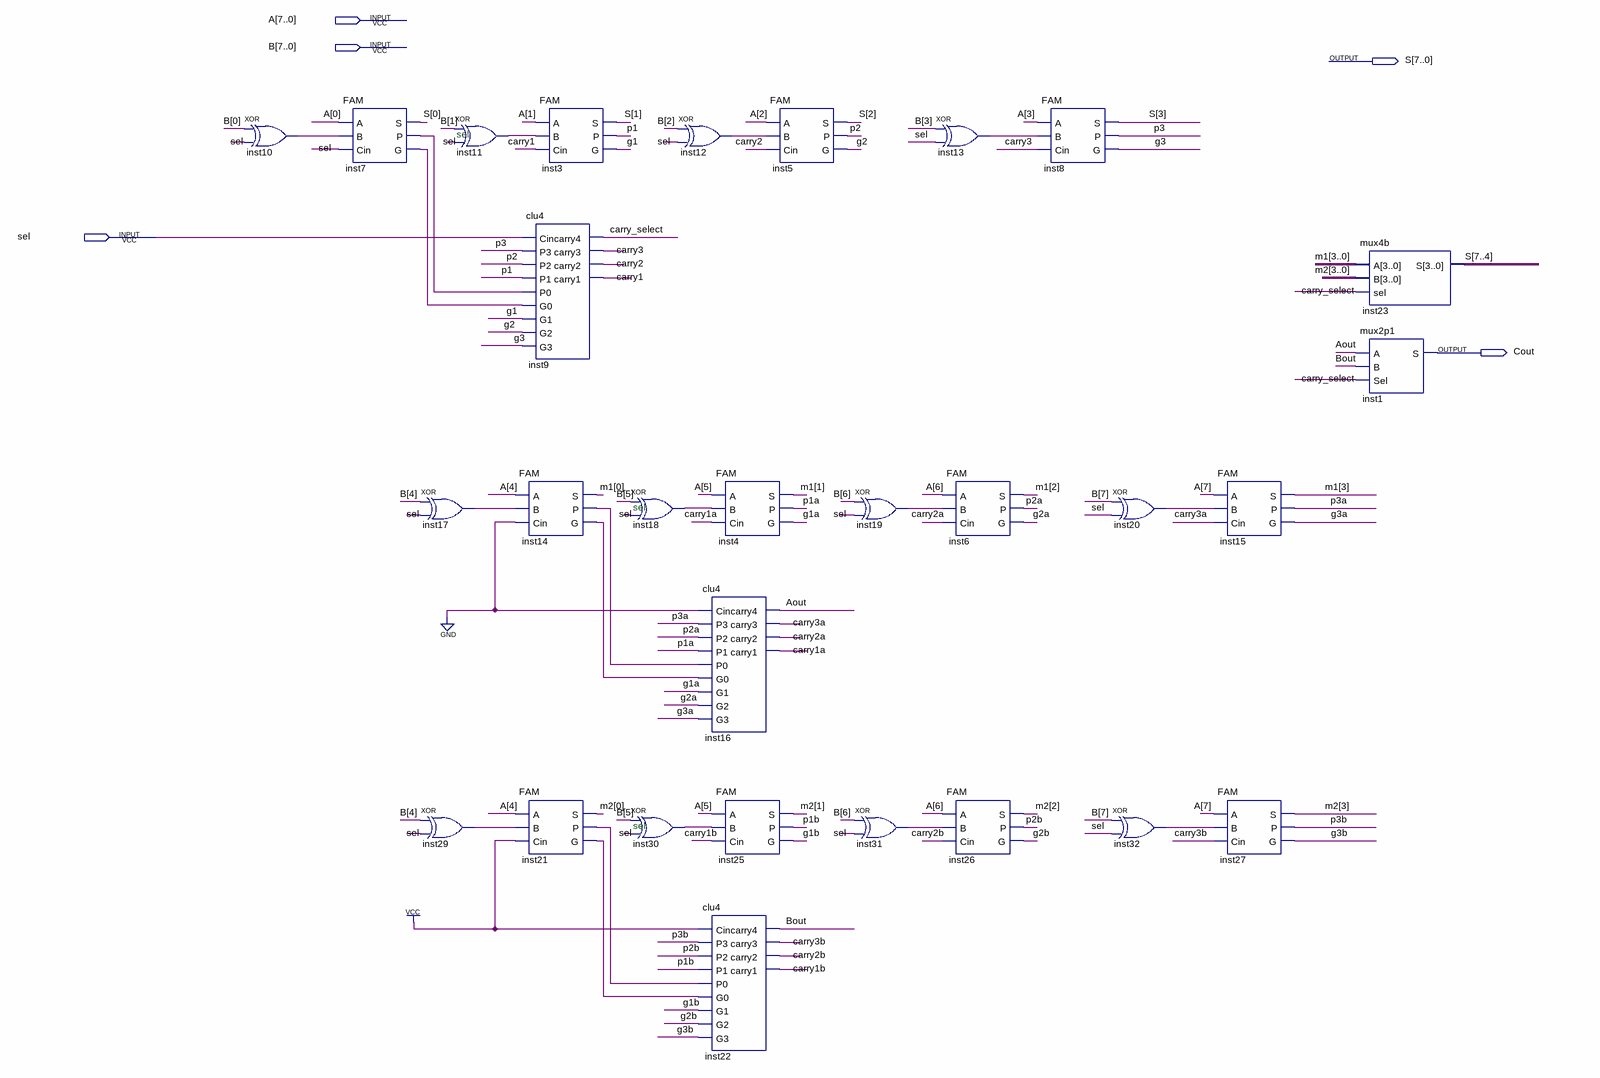
[diagram p0: schematic sheet]
// Quartus schematic cslaclas8.bdf as structural Verilog: 29 symbols, 5 pins
module cslaclas8 (
  input  [7:0] A,
  input  [7:0] B,
  input  sel,
  output [7:0] S,
  output Cout
);

  wire Aout, Bout, carry1, carry1a, carry1b, carry2, carry2a, carry2b, carry3, carry3a, carry3b,
       carry_select, g1, g1a, g1b, g2, g2a, g2b, g3, g3a, g3b, inst7_g, inst7_p, inst10_out, inst11_out,
       inst12_out, inst13_out, inst14_g, inst14_p, inst17_out, inst18_out, inst19_out, inst20_out, inst21_g,
       inst21_p, inst29_out, inst30_out, inst31_out, inst32_out, p1, p1a, p1b, p2, p2a, p2b, p3, p3a, p3b;
  wire [3:0] m1, m2;

  xor inst10 (inst10_out, B[0], sel);
  FAM inst7 (.A(A[0]), .B(inst10_out), .Cin(sel), .S(S[0]), .P(inst7_p), .G(inst7_g));
  xor inst17 (inst17_out, B[4], sel);
  xor inst29 (inst29_out, B[4], sel);
  xor inst11 (inst11_out, B[1], sel);
  FAM inst3 (.A(A[1]), .B(inst11_out), .Cin(carry1), .S(S[1]), .P(p1), .G(g1));
  clu4 inst9 (
    .Cin(sel), .P3(p3), .P2(p2), .P1(p1), .P0(inst7_p), .G0(inst7_g), .G1(g1), .G2(g2), .G3(g3),
    .carry4(carry_select), .carry3(carry3), .carry2(carry2), .carry1(carry1));
  FAM inst14 (.A(A[4]), .B(inst17_out), .Cin(1'b0), .S(m1[0]), .P(inst14_p), .G(inst14_g));
  FAM inst21 (.A(A[4]), .B(inst29_out), .Cin(1'b1), .S(m2[0]), .P(inst21_p), .G(inst21_g));
  xor inst18 (inst18_out, B[5], sel);
  xor inst30 (inst30_out, B[5], sel);
  xor inst12 (inst12_out, B[2], sel);
  clu4 inst16 (
    .Cin(1'b0), .P3(p3a), .P2(p2a), .P1(p1a), .P0(inst14_p), .G0(inst14_g), .G1(g1a), .G2(g2a), .G3(g3a),
    .carry4(Aout), .carry3(carry3a), .carry2(carry2a), .carry1(carry1a));
  clu4 inst22 (
    .Cin(1'b1), .P3(p3b), .P2(p2b), .P1(p1b), .P0(inst21_p), .G0(inst21_g), .G1(g1b), .G2(g2b), .G3(g3b),
    .carry4(Bout), .carry3(carry3b), .carry2(carry2b), .carry1(carry1b));
  FAM inst4 (.A(A[5]), .B(inst18_out), .Cin(carry1a), .S(m1[1]), .P(p1a), .G(g1a));
  FAM inst25 (.A(A[5]), .B(inst30_out), .Cin(carry1b), .S(m2[1]), .P(p1b), .G(g1b));
  FAM inst5 (.A(A[2]), .B(inst12_out), .Cin(carry2), .S(S[2]), .P(p2), .G(g2));
  xor inst19 (inst19_out, B[6], sel);
  xor inst31 (inst31_out, B[6], sel);
  xor inst13 (inst13_out, B[3], sel);
  FAM inst6 (.A(A[6]), .B(inst19_out), .Cin(carry2a), .S(m1[2]), .P(p2a), .G(g2a));
  FAM inst26 (.A(A[6]), .B(inst31_out), .Cin(carry2b), .S(m2[2]), .P(p2b), .G(g2b));
  FAM inst8 (.A(A[3]), .B(inst13_out), .Cin(carry3), .S(S[3]), .P(p3), .G(g3));
  xor inst20 (inst20_out, B[7], sel);
  xor inst32 (inst32_out, B[7], sel);
  FAM inst15 (.A(A[7]), .B(inst20_out), .Cin(carry3a), .S(m1[3]), .P(p3a), .G(g3a));
  FAM inst27 (.A(A[7]), .B(inst32_out), .Cin(carry3b), .S(m2[3]), .P(p3b), .G(g3b));
  mux4b inst23 (.A(m1), .B(m2), .sel(carry_select), .S(S[7:4]));
  mux2p1 inst1 (.A(Aout), .B(Bout), .Sel(carry_select), .S(Cout));

  // Notes on the sheet:
  //   sel
  //   sel
  //   sel
endmodule
